# EAGLE schematic dmpcb (EAGLE 9.4.2)
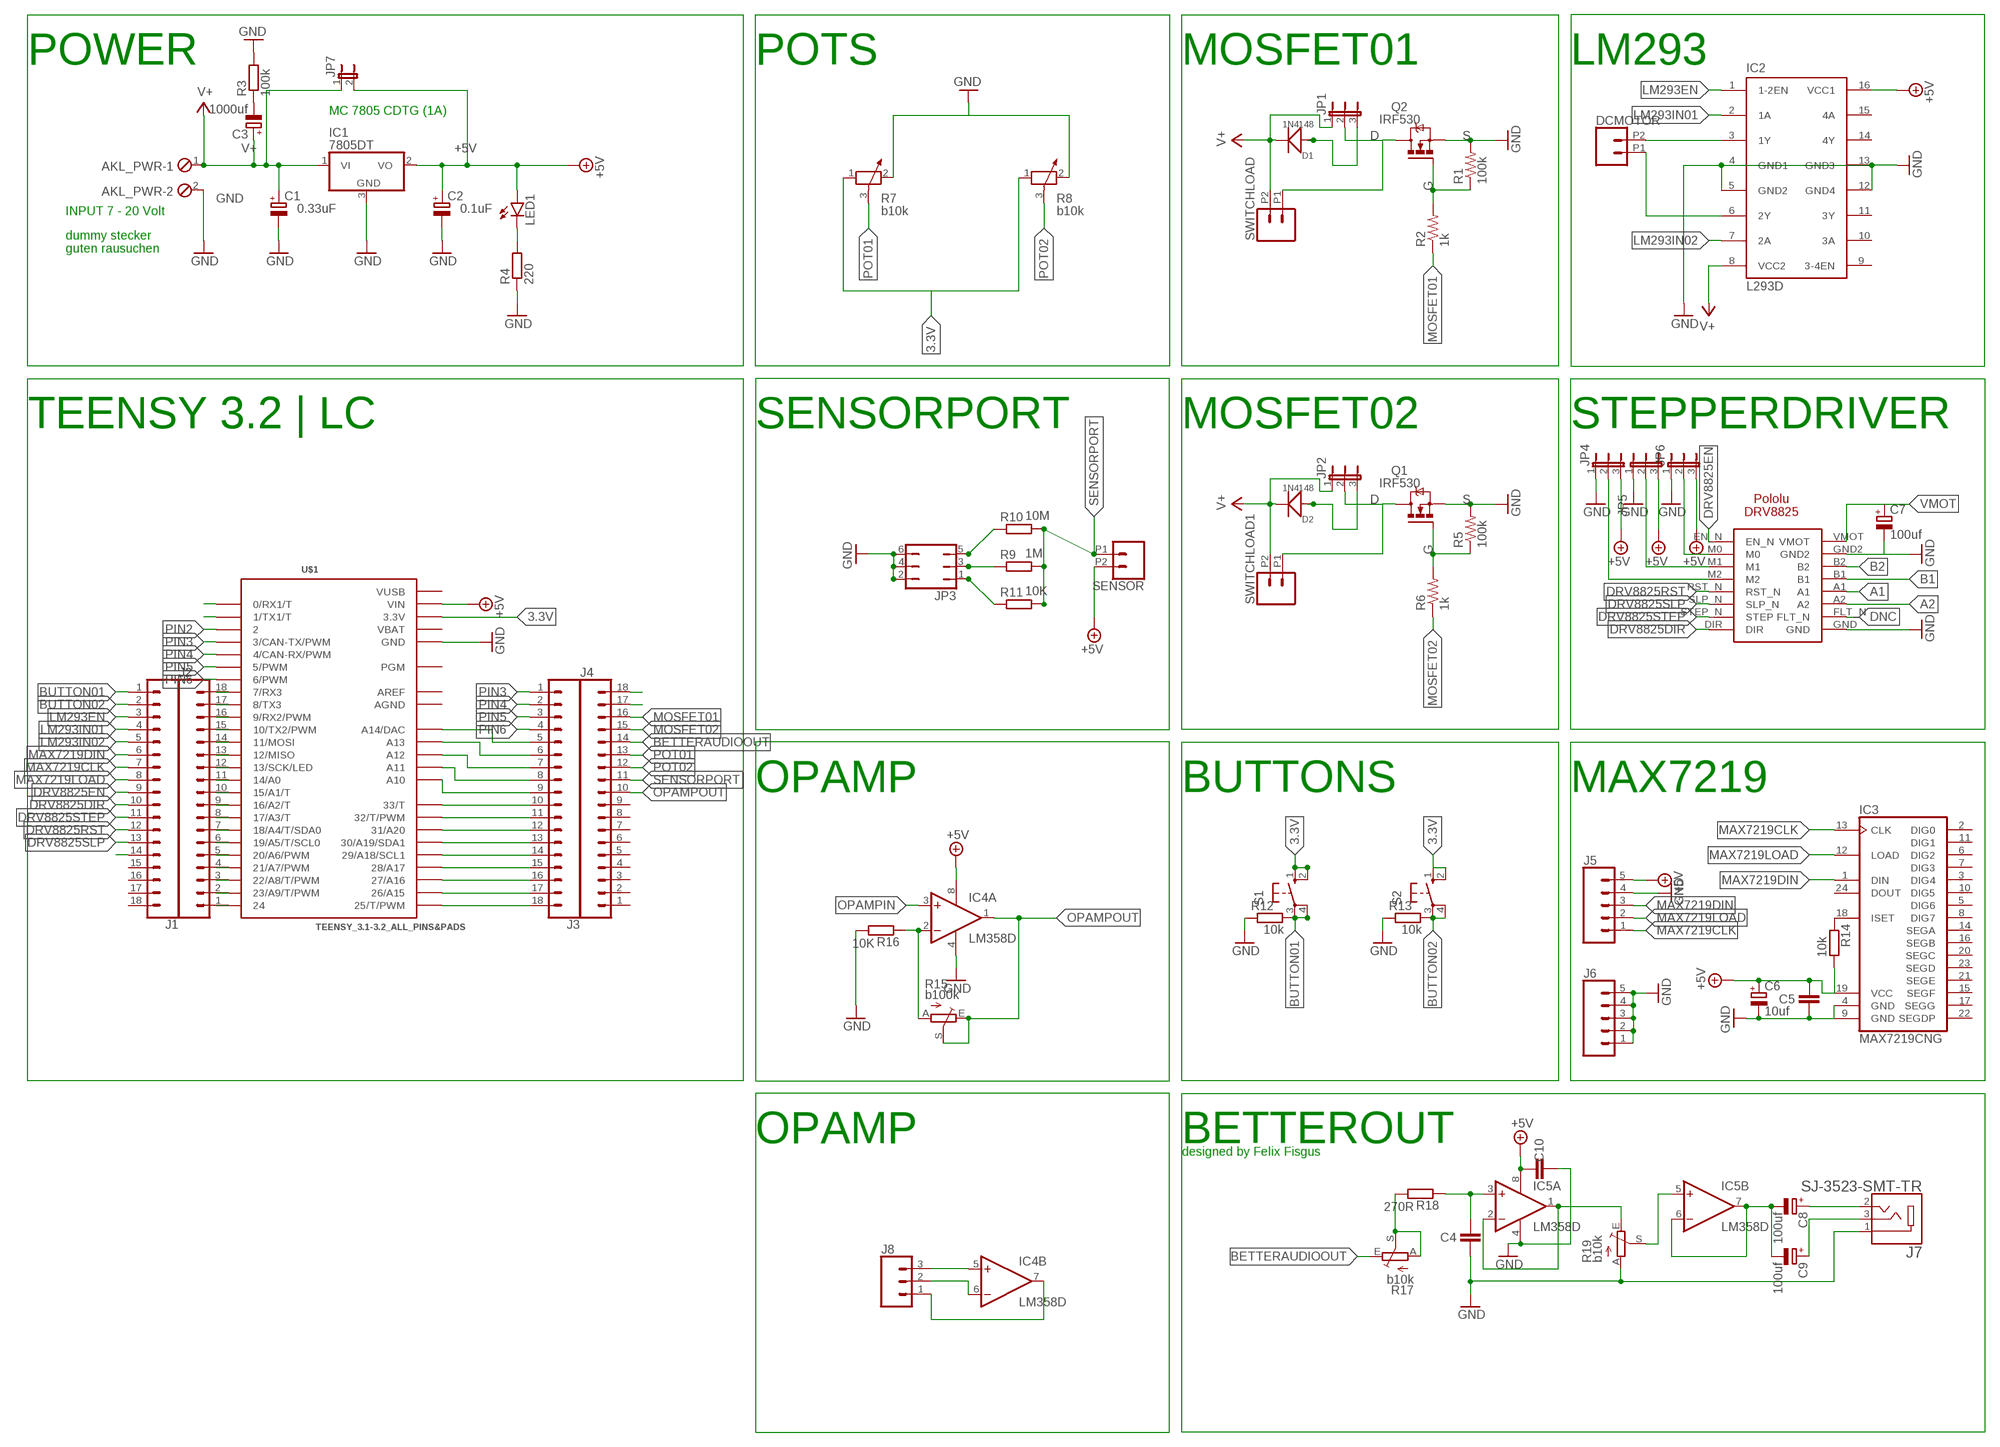
[diagram p0: schematic, sheet 1]

## Parts
AKL_PWR  MPT2  [2POL254]
C1  0.33uF  CPOL-EUSANYO_A'  [SANYO-OSCON_A']
C2  0.1uF  CPOL-EUSANYO_A'  [SANYO-OSCON_A']
C3  1000uf  CPOL-EUE3.5-8  [E3,5-8]
C4  100nf  C-EUC0805  [C0805]
C5  100nf  C-EUC0805  [C0805]
C6  10uf  CPOL-EUB  [PANASONIC_B]
C7  100uf  CPOL-EUD  [PANASONIC_D]
C8  100uf  CPOL-EUB  [PANASONIC_B]
C9  100uf  CPOL-EUB  [PANASONIC_B]
C10  100nf  C-EUC0805  [C0805]
D1  1N4148  SMD-DIODE-SWITCH-1N4148(LL-34)  [LL-34]
D2  1N4148  SMD-DIODE-SWITCH-1N4148(LL-34)  [LL-34]
DCMOTOR  CONN_022.54MM_SCREWTERM  [1X02_2.54_SCREWTERM]
IC1  7805DT  [TO252]
IC2  L293D  [DIL16]
IC3  MAX7219CNG  [DIL24-3]
IC4  LM358D  [SO08]
IC5  LM358D  [SO08]
J1  CONN_18  [1X18]
J2  CONN_18  [1X18]
J3  CONN_18  [1X18]
J4  CONN_18  [1X18]
J5  CONN_05  [1X05]
J6  CONN_05  [1X05]
J7  SJ-3523-SMT-TR  [CUI_SJ-3523-SMT-TR]
J8  CONN_03LOCK_LONGPADS  [1X03_LOCK_LONGPADS]
JP1  JP2E  [JP2]
JP2  JP2E  [JP2]
JP3  JP3Q  [JP3Q]
JP4  JP2E  [JP2]
JP5  JP2E  [JP2]
JP6  JP2E  [JP2]
JP7  JP1E  [JP1]
LED1  LEDSML0805  [SML0805]
Q1  IRF530  [TO220BV]
Q2  IRF530  [TO220BV]
R1  100k  R-US_R0805  [R0805]
R2  1k  R-US_R0805  [R0805]
R3  100k  R-EU_R0805  [R0805]
R4  220  R-EU_R0805  [R0805]
R5  100k  R-US_R0805  [R0805]
R6  1k  R-US_R0805  [R0805]
R7  b10k  POTENTIOMETER_PT-10  [PT-10]
R8  b10k  POTENTIOMETER_PT-10  [PT-10]
R9  1M  R-EU_M0805  [M0805]
R10  10M  R-EU_M0805  [M0805]
R11  10K  R-EU_M0805  [M0805]
R12  10k  R-EU_M0805  [M0805]
R13  10k  R-EU_M0805  [M0805]
R14  10k  R-EU_M0805  [M0805]
R15  b100k  TRIM_EU-RJ9W  [RJ9W]
R16  10K  R-EU_M0805  [M0805]
R17  b10k  TRIM_EU-RJ9W  [RJ9W]
R18  270R  R-EU_M0805  [M0805]
R19  b10k  TRIM_EU-RJ9W  [RJ9W]
S1  10-XX  [B3F-10XX]
S2  10-XX  [B3F-10XX]
SENSOR  CONN_022.54MM_SCREWTERM  [1X02_2.54_SCREWTERM]
SWITCHLOAD  CONN_022.54MM_SCREWTERM  [1X02_2.54_SCREWTERM]
SWITCHLOAD1  CONN_022.54MM_SCREWTERM  [1X02_2.54_SCREWTERM]
U$1  TEENSY_3.1-3.2_ALL_PINS&PADS  [TEENSY_3.0-3.2_ALL_PINS_&_PADS]
U$2  POLOLU-DRV8825  [POLOLU-DRV8825]

## Nets
3.3V: R7.1 R8.1 U$1.3.3V U$1.3.3V1(3.3V) U$1.3.3V2(3.3V)
+5V: C2.+ C5.1 C6.+ C10.2 IC1.2(VO) IC2.16(VCC1) IC3.19(VCC) IC4.8(P:V+) IC5.8(P:V+) J5.5 JP4.3 JP5.3 JP6.3 JP7.2 LED1.A R14.2 SENSOR.P2 U$1.VIN
A1: U$2.A1
A2: U$2.A2
B1: U$2.B1
B2: U$2.B2
BETTERAUDIOOUT: J4.14 R17.E
BUTTON01: J1.1 R12.2 S1.3(P) S1.4(P1)
BUTTON02: J1.2 R13.2 S2.3(P) S2.4(P1)
D: JP1.2 JP2.2 Q1.D Q2.D SWITCHLOAD1.P1 SWITCHLOAD.P1
DNC: U$2.FLT_N
DRV8825DIR: J1.10 U$2.DIR
DRV8825EN: J1.9 U$2.EN_N
DRV8825RST: J1.12 U$2.RST_N
DRV8825SLP: J1.13 U$2.SLP_N
DRV8825STEP: J1.11 U$2.STEP_N(STEP)
G: Q1.G Q2.G R1.1 R2.2 R5.1 R6.2
GND: AKL_PWR.2 C1.- C2.- C4.2 C5.2 C6.- C7.- C10.1 IC1.3(GND) IC2.4(GND1) IC2.5(GND2) IC2.12(GND4) IC2.13(GND3) IC3.4(GND) IC3.9(GND) IC4.4(P:V-) IC5.4(P:V-) J5.4 J6.1 J6.2 J6.3 J6.4 J6.5 J7.1 JP3.2 JP3.4 JP3.6 JP4.1 JP5.1 JP6.1 R3.2 R4.1 R7.2 R8.2 R12.1 R13.1 R16.2 R19.A U$1.GND U$1.GND1(GND) U$1.GND2(GND) U$2.GND U$2.GND2
LM293EN: IC2.1(1-2EN) J1.3
LM293IN01: IC2.2(1A) J1.4
LM293IN02: IC2.7(2A) J1.5
MAX7219CLK: IC3.13(CLK) J1.7 J5.1
MAX7219DIN: IC3.1(DIN) J1.6 J5.3
MAX7219LOAD: IC3.12(LOAD) J1.8 J5.2
MOSFET01: J4.16 R2.1
MOSFET02: J4.15 R6.1
N$5: DCMOTOR.P2 IC2.3(1Y)
N$6: DCMOTOR.P1 IC2.6(2Y)
N$8: C3.- R3.1
N$9: LED1.C R4.2
N$11: D2.A(+) JP2.3
N$12: D1.A(+) JP1.3
N$16: JP3.5 R10.1
N$17: JP3.3 R9.1
N$18: JP3.1 R11.1
N$19: S1.1(S) S1.2(S1)
N$20: IC4.5(B:+IN) J8.3
N$21: S2.1(S) S2.2(S1)
N$22: J2.1 U$1.24
N$23: J2.2 U$1.23/A9(23/A9/T/PWM)
N$25: IC3.18(ISET) R14.1
N$26: J2.3 U$1.22/A8(22/A8/T/PWM)
N$27: J2.4 U$1.21/A7(21/A7/PWM)
N$28: J2.5 U$1.20/A6(20/A6/PWM)
N$29: J2.6 U$1.19/A5(19/A5/T/SCL0)
N$30: J2.7 U$1.18/A4(18/A4/T/SDA0)
N$31: J2.8 U$1.17/A3(17/A3/T)
N$32: J2.9 U$1.16/A2(16/A2/T)
N$33: J2.10 U$1.15/A1(15/A1/T)
N$34: J2.11 U$1.14/A0
N$35: J2.12 U$1.13(13/SCK/LED)
N$36: J2.13 U$1.12(12/MISO)
N$37: J2.14 U$1.11(11/MOSI)
N$38: J2.15 U$1.10(10/TX2/PWM)
N$39: J2.16 U$1.9(9/RX2/PWM)
N$40: J2.17 U$1.8(8/TX3)
N$41: J2.18 U$1.7(7/RX3)
N$42: J3.18 U$1.25(25/T/PWM)
N$43: J3.17 U$1.26(26/A15)
N$44: J3.16 U$1.27(27/A16)
N$45: J3.15 U$1.28(28/A17)
N$46: J3.14 U$1.29(29/A18/SCL1)
N$47: J3.13 U$1.30(30/A19/SDA1)
N$48: J3.12 U$1.31(31/A20)
N$49: J3.11 U$1.32(32/T/PWM)
N$50: J3.10 U$1.33(33/T)
N$51: J3.9 U$1.A10
N$52: J3.8 U$1.A11
N$53: J3.7 U$1.A12
N$54: J3.6 U$1.A13
N$55: J3.5 U$1.RESET/DAC(A14/DAC)
N$56: J4.17
N$57: JP4.2 U$2.M2
N$58: JP5.2 U$2.M1
N$59: JP6.2 U$2.M0
N$61: U$1.1(1/TX1/T)
N$62: U$1.0(0/RX1/T)
N$63: IC4.2(A:-IN) R15.A R16.1
N$64: J1.14
N$66: C8.+ J7.2
N$67: R17.A R17.S R18.2
N$68: C4.1 IC5.3(A:+IN) R18.1
N$69: IC5.1(A:OUT) IC5.2(A:-IN) R19.E
N$70: IC4.6(B:-IN) J8.2
N$71: IC5.5(B:+IN) R19.S
N$72: C8.- C9.- IC5.6(B:-IN) IC5.7(B:OUT)
N$73: C9.+ J7.3
N$75: IC4.7(B:OUT) J8.1
OPAMPIN: IC4.3(A:+IN)
OPAMPOUT: IC4.1(A:OUT) J4.10 R15.E R15.S
PIN2: U$1.2
PIN3: J3.1 U$1.3(3/CAN-TX/PWM)
PIN4: J3.2 U$1.4(4/CAN-RX/PWM)
PIN5: J3.3 U$1.5(5/PWM)
PIN6: J3.4 U$1.6(6/PWM)
POT01: J4.13 R7.3
POT02: J4.12 R8.3
S: Q1.S Q2.S R1.2 R5.2 ; supply symbol labelled GND
SENSORPORT: J4.11 J4.18 R9.2 R10.2 R11.2 SENSOR.P1
V+: AKL_PWR.1 C1.+ C3.+ D1.C(-) D2.C(-) IC1.1(VI) IC2.8(VCC2) JP1.1 JP2.1 JP7.1 SWITCHLOAD1.P2 SWITCHLOAD.P2
VMOT: C7.+ U$2.VMOT
Unconnected: IC2.9(3-4EN) IC2.10(3A) IC2.11(3Y) IC2.14(4Y) IC2.15(4A) IC3.2(DIG0) IC3.3(DIG4) IC3.5(DIG6) IC3.6(DIG2) IC3.7(DIG3) IC3.8(DIG7) IC3.10(DIG5) IC3.11(DIG1) IC3.14(SEGA) IC3.15(SEGF) IC3.16(SEGB) IC3.17(SEGG) IC3.20(SEGC) IC3.21(SEGE) IC3.22(SEGDP) IC3.23(SEGD) IC3.24(DOUT) J1.15 J1.16 J1.17 J1.18 J4.1 J4.2 J4.3 J4.4 J4.5 J4.6 J4.7 J4.8 J4.9 U$1.PGM

## Notes on the sheet
- POWER | POTS | MOSFET01 | LM293
- MC 7805 CDTG (1A)
- INPUT 7 - 20 Volt
- dummy stecker
  guten rausuchen
- TEENSY 3.2 | LC | SENSORPORT | MOSFET02 | STEPPERDRIVER
- OPAMP | BUTTONS | MAX7219
- OPAMP | BETTEROUT
- designed by Felix Fisgus

## Power pins joined to a net without a drawn wire
AGND: U$1.AGND
AREF: U$1.AREF
VBAT: U$1.VBAT
VUSB: U$1.VUSB

## Library data of the parts
AKL_PWR = con-phoenix-254:MPT2: PHOENIX CONNECTOR; OC_FARNELL: unknown; OC_NEWARK: unknown
C1-C3 C6-C9 = rcl:CPOL-EU: POLARIZED CAPACITOR, European symbol; SPICEPREFIX: C
C4 C5 C10 = rcl:C-EU: CAPACITOR, European symbol; SPICEPREFIX: C
D1 D2 = Seeed-Diode:SMD-DIODE-SWITCH-1N4148(LL-34): 304040016; MPN: 1N4148
DCMOTOR SENSOR SWITCHLOAD SWITCHLOAD1 = SparkFun-Connectors:CONN_02: Multi connection point. Often used as Generic Header-pin footprint for 0.1 inch spaced/style header connections On any of the 0.1 inch spaced packages, you can populate with these: Break Away Headers - Straight <https://www.sparkfun.com/products/116> (PRT-00116) Break Away Male Headers - Right Angle <https://www.sparkfun.com/products/553> (PRT-00553) Female Headers <https://www.sparkfun.com/products/115> (PRT-00115) Break Away Headers - Machine Pin <https://www.sparkfun.com/products/117> (PRT-00117) Break Away Female Headers - Swiss Machine Pin <https://www.sparkfun.com/products/743> (PRT-00743) For SCREWTERMINALS and SPRING TERMINALS visit here: Screw Terimnals on SparkFun.com <https://www.sparkfun.com/search/results?term=Screw+Terminals> (5mm/3.5mm/2.54mm spacing) This device is also useful as a general connection point to wire up your design to another part of your project. Our various solder wires solder well into these plated through hole pads. Hook-Up Wire - Assortment (Stranded, 22 AWG) <https://www.sparkfun.com/products/11375> (PRT-11375) Hook-Up Wire - Assortment (Solid Core, 22 AWG) <https://www.sparkfun.com/products/11367> (PRT-11367) View the entire wire category on our website here <https://www.sparkfun.com/categories/141> Special notes: Molex polarized connector foot print use with: PRT-08233 with associated crimp pins and housings. 2.54_SCREWTERM for use with PRT-10571. 3.5mm Screw Terminal footprints for PRT-08084 5mm Screw Terminal footprints for use with PRT-08432
IC1 = linear:78*: Positive VOLTAGE REGULATOR Source: http://cache.national.com/ds/LM/LM78L05.pdf http://www.fairchildsemi.com/ds/LM/LM7805.pdf
IC2 = st-microelectronics:L293D: PUSH-PULL 4 CHANNEL DRIVER; MPN: L293D; OC_FARNELL: 9589619; OC_NEWARK: 56P8249
IC3 = maxim:MAX7219CNG: LED DISPLAY DRIVER; MF: MAXIM; MPN: MAX7219CNG; OC_FARNELL: 1523914; OC_NEWARK: 34C4018
IC4 IC5 = linear:LM358: OP AMP also LM158; LM258; LM2904 Source: http://cache.national.com/ds/LM/LM158.pdf
J1-J4 = SparkFun-Connectors:CONN_18: Multi connection point. Often used as Generic Header-pin footprint for 0.1 inch spaced/style header connections On any of the 0.1 inch spaced packages, you can populate with these: Break Away Headers - Straight <https://www.sparkfun.com/products/116> (PRT-00116) Break Away Male Headers - Right Angle <https://www.sparkfun.com/products/553> (PRT-00553) Female Headers <https://www.sparkfun.com/products/115> (PRT-00115) Break Away Headers - Machine Pin <https://www.sparkfun.com/products/117> (PRT-00117) Break Away Female Headers - Swiss Machine Pin <https://www.sparkfun.com/products/743> (PRT-00743) For SCREWTERMINALS and SPRING TERMINALS visit here: Screw Terimnals on SparkFun.com <https://www.sparkfun.com/search/results?term=Screw+Terminals> (5mm/3.5mm/2.54mm spacing) This device is also useful as a general connection point to wire up your design to another part of your project. Our various solder wires solder well into these plated through hole pads. Hook-Up Wire - Assortment (Stranded, 22 AWG) <https://www.sparkfun.com/products/11375> (PRT-11375) Hook-Up Wire - Assortment (Solid Core, 22 AWG) <https://www.sparkfun.com/products/11367> (PRT-11367) View the entire wire category on our website here <https://www.sparkfun.com/categories/141> Special notes: Molex polarized connector foot print use with SKU : PRT-08231 with associated crimp pins and housings. 1MM SMD Version SKU: PRT-10208 NOTES ON THE VARIANTS LOCK and LOCK_LONGPADS... This footprint was designed to help hold the alignment of a through-hole component (i.e. 6-pin header) while soldering it into place. You may notice that each hole has been shifted either up or down by 0.005 of an inch from it's more standard position (which is a perfectly straight line). This slight alteration caused the pins (the squares in the middle) to touch the edges of the holes. Because they are alternating, it causes a "brace" to hold the component in place. 0.005 has proven to be the perfect amount of "off-center" position when using our standard breakaway headers. Although looks a little odd when you look at the bare footprint, once you have a header in there, the alteration is very hard to notice. Also,if you push a header all the way into place, it is covered up entirely on the bottom side.
J5 J6 = SparkFun-Connectors:CONN_05: Multi connection point. Often used as Generic Header-pin footprint for 0.1 inch spaced/style header connections On any of the 0.1 inch spaced packages, you can populate with these: Break Away Headers - Straight <https://www.sparkfun.com/products/116> (PRT-00116) Break Away Male Headers - Right Angle <https://www.sparkfun.com/products/553> (PRT-00553) Female Headers <https://www.sparkfun.com/products/115> (PRT-00115) Break Away Headers - Machine Pin <https://www.sparkfun.com/products/117> (PRT-00117) Break Away Female Headers - Swiss Machine Pin <https://www.sparkfun.com/products/743> (PRT-00743) For SCREWTERMINALS and SPRING TERMINALS visit here: Screw Terimnals on SparkFun.com <https://www.sparkfun.com/search/results?term=Screw+Terminals> (5mm/3.5mm/2.54mm spacing) This device is also useful as a general connection point to wire up your design to another part of your project. Our various solder wires solder well into these plated through hole pads. Hook-Up Wire - Assortment (Stranded, 22 AWG) <https://www.sparkfun.com/products/11375> (PRT-11375) Hook-Up Wire - Assortment (Solid Core, 22 AWG) <https://www.sparkfun.com/products/11367> (PRT-11367) View the entire wire category on our website here <https://www.sparkfun.com/categories/141> Special notes: Molex polarized connector foot print use with SKU : PRT-08231 with associated crimp pins and housings. 1MM SMD Version SKU: PRT-10208
J7 = SJ-3523-SMT-TR:SJ-3523-SMT-TR: Audio Jack Connector 3.5 mm Low Profile Surface Mount Stereo Jack, 3 Pin Right-Angle; MF: CUI Inc; STANDARD: Manufacturer recommendations
J8 = SparkFun-Connectors:CONN_03: Multi connection point. Often used as Generic Header-pin footprint for 0.1 inch spaced/style header connections On any of the 0.1 inch spaced packages, you can populate with these: Break Away Headers - Straight <https://www.sparkfun.com/products/116> (PRT-00116) Break Away Male Headers - Right Angle <https://www.sparkfun.com/products/553> (PRT-00553) Female Headers <https://www.sparkfun.com/products/115> (PRT-00115) Break Away Headers - Machine Pin <https://www.sparkfun.com/products/117> (PRT-00117) Break Away Female Headers - Swiss Machine Pin <https://www.sparkfun.com/products/743> (PRT-00743) Stackable Header - 3 Pin (Female, 0.1") <https://www.sparkfun.com/products/13875> (PRT-13875) For SCREWTERMINALS and SPRING TERMINALS visit here: Screw Terimnals on SparkFun.com <https://www.sparkfun.com/search/results?term=Screw+Terminals> (5mm/3.5mm/2.54mm spacing) This device is also useful as a general connection point to wire up your design to another part of your project. Our various solder wires solder well into these plated through hole pads. Hook-Up Wire - Assortment (Stranded, 22 AWG) <https://www.sparkfun.com/products/11375> (PRT-11375) Hook-Up Wire - Assortment (Solid Core, 22 AWG) <https://www.sparkfun.com/products/11367> (PRT-11367) View the entire wire category on our website here <https://www.sparkfun.com/categories/141> Special notes: Molex polarized connector foot print use with SKU : PRT-08232 with associated crimp pins and housings.
JP1 JP2 JP4-JP6 = jumper:JP2E: JUMPER
JP3 = jumper:JP3Q: JUMPER
JP7 = jumper:JP1E: JUMPER
LED1 = led:LED: LED OSRAM: - CHIPLED LG R971, LG N971, LY N971, LG Q971, LY Q971, LO R971, LY R971 LH N974, LH R974 LS Q976, LO Q976, LY Q976 LO Q996 - Hyper CHIPLED LW Q18S LB Q993, LB Q99A, LB R99A - SideLED LS A670, LO A670, LY A670, LG A670, LP A670 LB A673, LV A673, LT A673, LW A673 LH A674 LY A675 LS A676, LA A676, LO A676, LY A676, LW A676 LS A679, LY A679, LG A679 - Hyper Micro SIDELED® LS Y876, LA Y876, LO Y876, LY Y876 LT Y87S - SmartLED LW L88C, LW L88S LB L89C, LB L89S, LG L890 LS L89K, LO L89K, LY L89K LS L896, LA L896, LO L896, LY L896 - TOPLED LS T670, LO T670, LY T670, LG T670, LP T670 LSG T670, LSP T670, LSY T670, LOP T670, LYG T670 LG T671, LOG T671, LSG T671 LB T673, LV T673, LT T673, LW T673 LH T674 LS T676, LA T676, LO T676, LY T676, LB T676, LH T676, LSB T676, LW T676 LB T67C, LV T67C, LT T67C, LS T67K, LO T67K, LY T67K, LW E67C LS E67B, LA E67B, LO E67B, LY E67B, LB E67C, LV E67C, LT E67C LW T67C LS T679, LY T679, LG T679 LS T770, LO T770, LY T770, LG T770, LP T770 LB T773, LV T773, LT T773, LW T773 LH T774 LS E675, LA E675, LY E675, LS T675 LS T776, LA T776, LO T776, LY T776, LB T776 LHGB T686 LT T68C, LB T68C - Hyper Mini TOPLED® LB M676 - Mini TOPLED Santana® LG M470 LS M47K, LO M47K, LY M47K Source: http://www.osram.convergy.de LUXEON: - LUMILED® LXK2-PW12-R00, LXK2-PW12-S00, LXK2-PW14-U00, LXK2-PW14-V00 LXK2-PM12-R00, LXK2-PM12-S00, LXK2-PM14-U00 LXK2-PE12-Q00, LXK2-PE12-R00, LXK2-PE12-S00, LXK2-PE14-T00, LXK2-PE14-U00 LXK2-PB12-K00, LXK2-PB12-L00, LXK2-PB12-M00, LXK2-PB14-N00, LXK2-PB14-P00, LXK2-PB14-Q00 LXK2-PR12-L00, LXK2-PR12-M00, LXK2-PR14-Q00, LXK2-PR14-R00 LXK2-PD12-Q00, LXK2-PD12-R00, LXK2-PD12-S00 LXK2-PH12-R00, LXK2-PH12-S00 LXK2-PL12-P00, LXK2-PL12-Q00, LXK2-PL12-R00 Source: www.luxeon.com KINGBRIGHT: KA-3528ASYC Source: www.kingbright.com
Q1 Q2 = transistor-power:IRF530: HEXFET Power MOSFET
R1 R2 R5 R6 = resistor:R-US_: RESISTOR, American symbol
R3 R4 R9-R14 R16 R18 = rcl:R-EU_: RESISTOR, European symbol; SPICEPREFIX: R
R7 R8 = rcl:POTENTIOMETER_: Potentiometer; SPICEMODEL: POT; SPICEPREFIX: X
R15 R17 R19 = pot:TRIM_EU-: POTENTIOMETER
S1 S2 = switch-omron:10-XX: OMRON SWITCH; MPN: B3F-1000; OC_FARNELL: 176432; OC_NEWARK: 36M3542
U$1 = Teensy_3_and_LC_Series_Boards_v1.4:TEENSY_3.1-3.2_ALL_PINS&PADS: Footprint for Teensy 3.1 or 3.2 board using all pads and all through-holes. Pads need a 2x7 0.1" SMD header.
U$2 = alvarop-lib:POLOLU-DRV8825